# Altium project OvcharkaBoard.PrjPcb
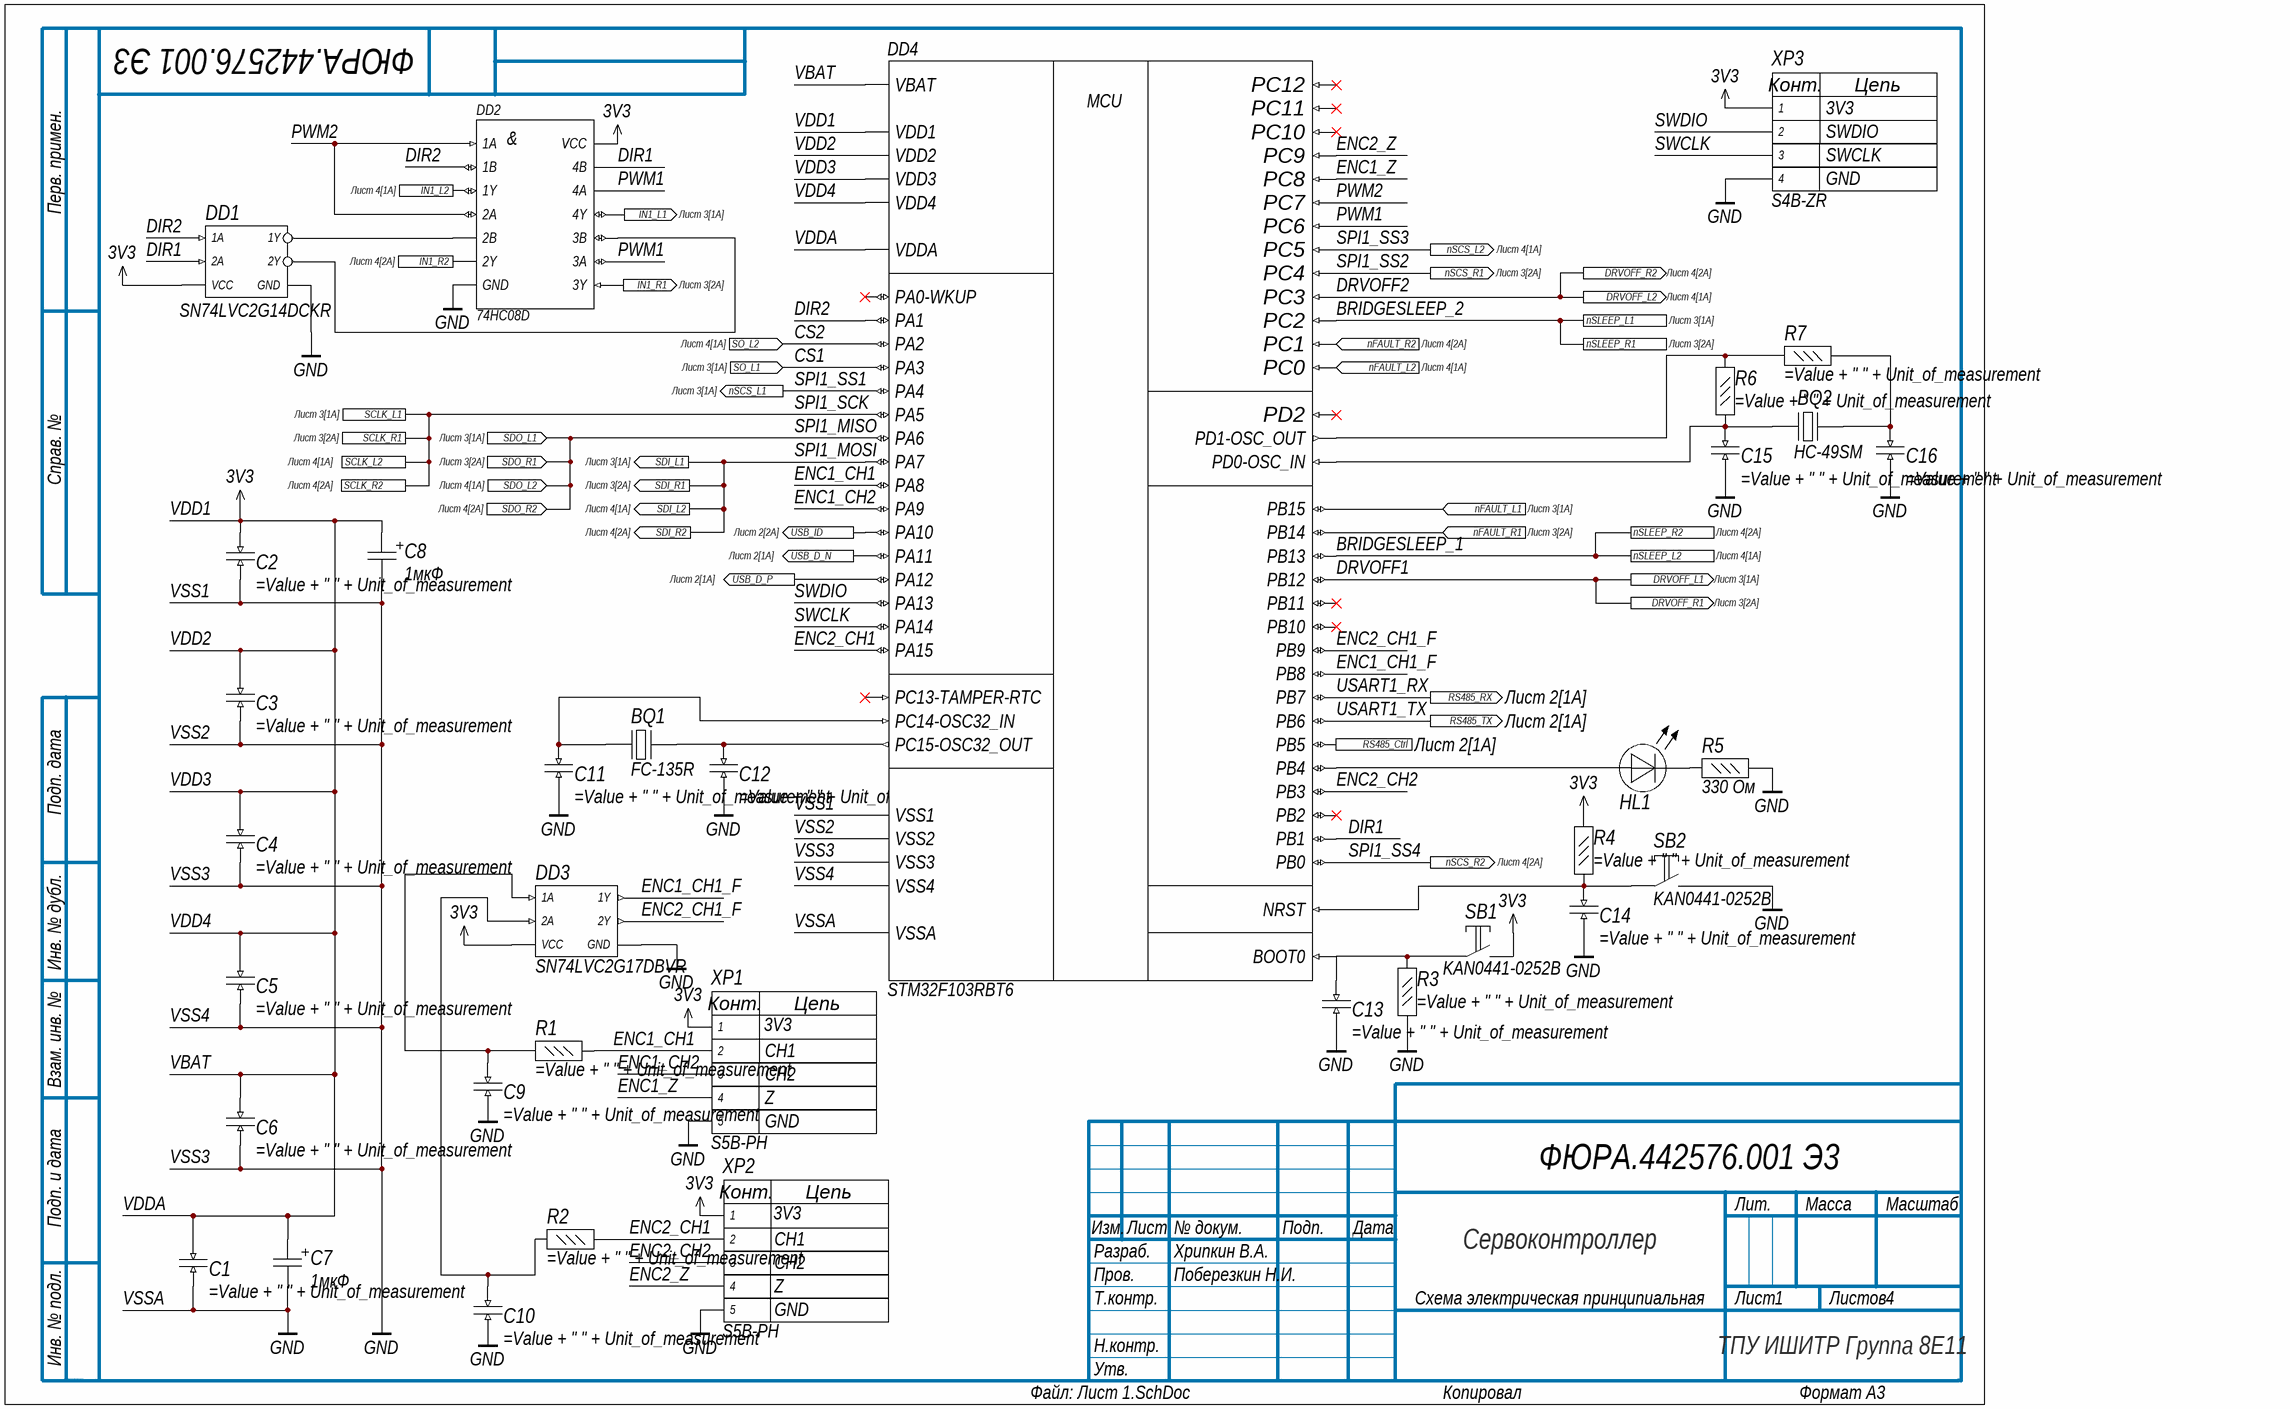
[diagram p0: Лист 1.SchDoc]
4 sheets, 116 parts. Net scope: flat (ports and power ports of the same name join across sheets).
Board file: OvcharkaBoard.PcbDoc
Sheets:
  Лист 1.SchDoc
  Лист 2.SchDoc
  Лист 3.SchDoc
  Лист 4.SchDoc

## Sheet Лист 1.SchDoc
size 420 x 297 mm; Author: ALTIUM GOSTBOM2.0 KEV; DrawnBy: Khripkinvlan; SheetNumber: 1; SheetTotal: 4; Вид_документа_SCH: Схема электрическая принципиальная; Наименование2: Сервоконтроллер; п_Разраб_Р: Хрипкин В.А.; п_Пров_Р: Поберезкин Н.И.; Наименование_организации: ТПУ ИШИТР Группа 8Е11; Обозначение_Код: ФЮРА.442576.001 Э3

### Parts
BQ1  FC-135R  [FC-135R]
BQ2  HC-49SM  [HC-49SM]
C1  (no value)  [CAP_0603]
C2  (no value)  [CAP_0603]
C3  (no value)  [CAP_0603]
C4  (no value)  [CAP_0603]
C5  (no value)  [CAP_0603]
C6  (no value)  [CAP_0603]
C7  1мкФ  [TECAP_A]
C8  1мкФ  [TECAP_A]
C9  (no value)  [CAP_0603]
C10  (no value)  [CAP_0603]
C11  (no value)  [CAP_0603]
C12  (no value)  [CAP_0603]
C13  (no value)  [CAP_0603]
C14  (no value)  [CAP_0603]
C15  (no value)  [CAP_0603]
C16  (no value)  [CAP_0603]
DD1  SN74LVC2G14DCKR  [SOT363 (SC70-6)]
DD2  74HC08D  [SO14]
DD3  SN74LVC2G17DBVR  [SOT23-6]
DD4  STM32F103RBT6  [LQFP-64]
HL1  3  [LED_0805]  (value not drawn)
R1  (no value)  [RES_0603]
R2  (no value)  [RES_0603]
R3  (no value)  [RES_0603]
R4  (no value)  [RES_0603]
R5  330 Ом  [RES_0603]
R6  (no value)  [RES_0603]
R7  (no value)  [RES_0603]
SB1  KAN0441-0252B  [SMD-BUTTON_6x3.5]
SB2  KAN0441-0252B  [SMD-BUTTON_6x3.5]
XP1  S5B-PH  [S5B-PH-K-S]
XP2  S5B-PH  [S5B-PH-K-S]
XP3  S4B-ZR  [S4B-ZR-SM4A-TF]

### Ports
DRVOFF_L1 (out, see Лист 3[1A]), DRVOFF_L2 (out, see Лист 4[1A]), DRVOFF_R1 (out, see Лист 3[2A]), DRVOFF_R2 (out, see Лист 4[2A]), IN1_L1 (out, see Лист 3[1A]), IN1_L2 (out, see Лист 4[1A]), IN1_R1 (out, see Лист 3[2A]), IN1_R2 (out, see Лист 4[2A]), nFAULT_L1 (in, see Лист 3[1A]), nFAULT_L2 (in, see Лист 4[1A]), nFAULT_R1 (in, see Лист 3[2A]), nFAULT_R2 (in, see Лист 4[2A]), nSCS_L1 (out, see Лист 3[1A]), nSCS_L2 (out, see Лист 4[1A]), nSCS_R1 (out, see Лист 3[2A]), nSCS_R2 (out, see Лист 4[2A]), nSLEEP_L1 (see Лист 3[1A]), nSLEEP_L2 (see Лист 4[1A]), nSLEEP_R1 (see Лист 3[2A]), nSLEEP_R2 (see Лист 4[2A]), RS485_Ctrl (out, see Лист 2[1A]), RS485_RX (out, see Лист 2[1A]), RS485_TX (out, see Лист 2[1A]), SCLK_L1 (see Лист 3[1A]), SCLK_L2 (see Лист 4[1A]), SCLK_R1 (see Лист 3[2A]), SCLK_R2 (see Лист 4[2A]), SDI_L1 (out, see Лист 3[1A]), SDI_L2 (out, see Лист 4[1A]), SDI_R1 (out, see Лист 3[2A]), SDI_R2 (out, see Лист 4[2A]), SDO_L1 (in, see Лист 3[1A]), SDO_L2 (in, see Лист 4[1A]), SDO_R1 (in, see Лист 3[2A]), SDO_R2 (in, see Лист 4[2A]), SO_L1 (in, see Лист 3[1A]), SO_L2 (in, see Лист 4[1A]), USB_D_N (out, see Лист 2[1A]), USB_D_P (out, see Лист 2[1A]), USB_ID (out, see Лист 2[2A])

### Nets
GND: C1.1 C2.1 C3.1 C4.1 C5.1 C6.1 C7.2 C8.2 C9.1 C10.1 C11.1 C12.1 C13.1 C14.1 C15.1 C16.1 DD1.2(GND) DD2.7(GND) DD3.2(GND) DD4.12(VSSA) DD4.18(VSS1) DD4.31(VSS2) DD4.47(VSS3) DD4.63(VSS4) R3.2 R5.2 SB2.2(S2) XP1.5 XP2.5 XP3.4  [also labelled VSS1, VSS2, VSS3, VSS4, VSSA]  [project net SL1]
VBAT: C1.2 C2.2 C3.2 C4.2 C5.2 C6.2 C7.1 C8.1 DD1.5(VCC) DD2.14(VCC) DD3.5(VCC) DD4.1(VBAT) DD4.13(VDDA) DD4.19(VDD1) DD4.32(VDD2) DD4.48(VDD3) DD4.64(VDD4) R4.2 SB1.2(S2) XP1.1 XP2.1 XP3.1  [also labelled 3V3, VDD1, VDD2, VDD3, VDD4, VDDA]
BRIDGESLEEP_1: DD4.34(PB13) ; port nSLEEP_L2, port nSLEEP_R2
BRIDGESLEEP_2: DD4.10(PC2) ; port nSLEEP_L1, port nSLEEP_R1
CS1: DD4.17(PA3) ; port SO_L1
CS2: DD4.16(PA2) ; port SO_L2
DIR1: DD1.3(2A) DD2.13(4B) DD4.27(PB1)  [project net DIR1_1]
DIR2: DD1.1(1A) DD2.2(1B) DD4.15(PA1)  [project net DIR2_1]
DRVOFF1: DD4.33(PB12) ; port DRVOFF_L1, port DRVOFF_R1
DRVOFF2: DD4.11(PC3) ; port DRVOFF_L2, port DRVOFF_R2
ENC1_CH1: DD4.41(PA8) R1.2 XP1.2  [project net ENC1_CH1_1]
ENC1_CH1_F: DD3.6(1Y) DD4.61(PB8)  [project net ENC1_CH1_F_1]
ENC1_CH2: DD4.42(PA9) XP1.3  [project net ENC1_CH2_1]
ENC1_Z: DD4.39(PC8) XP1.4  [project net ENC1_Z_1]
ENC2_CH1: DD4.50(PA15) R2.2 XP2.2  [project net ENC2_CH1_1]
ENC2_CH1_F: DD3.4(2Y) DD4.62(PB9)  [project net ENC2_CH1_F_1]
ENC2_CH2: DD4.55(PB3) XP2.3  [project net ENC2_CH2_1]
ENC2_Z: DD4.40(PC9) XP2.4  [project net ENC2_Z_1]
PWM1: DD2.9(3A) DD2.12(4A) DD4.37(PC6)  [project net PWM1_1]
PWM2: DD2.1(1A) DD2.4(2A) DD4.38(PC7)  [project net PWM2_1]
SPI1_MISO: DD4.22(PA6) ; port SDO_L1, port SDO_R1, port SDO_L2, port SDO_R2
SPI1_MOSI: DD4.23(PA7) ; port SDI_L1, port SDI_R1, port SDI_L2, port SDI_R2
SPI1_SCK: DD4.21(PA5) ; port SCLK_L1, port SCLK_R1, port SCLK_L2, port SCLK_R2
SPI1_SS1: DD4.20(PA4) ; port nSCS_L1
SPI1_SS2: DD4.24(PC4) ; port nSCS_R1
SPI1_SS3: DD4.25(PC5) ; port nSCS_L2
SPI1_SS4: DD4.26(PB0) ; port nSCS_R2
SWCLK: DD4.49(PA14) XP3.3  [project net SWCLK_1]
SWDIO: DD4.46(PA13) XP3.2  [project net SWDIO_1]
USART1_RX: DD4.59(PB7) ; port RS485_RX
USART1_TX: DD4.58(PB6) ; port RS485_TX
USB_D_N: DD4.44(PA11) ; port USB_D_N
USB_D_P: DD4.45(PA12) ; port USB_D_P
NetBQ1_1: BQ1.1 C11.2 DD4.3(PC14-OSC32_IN)
NetBQ1_2: BQ1.2 C12.2 DD4.4(PC15-OSC32_OUT)
NetBQ2_1: BQ2.1 C15.2 DD4.5(PD0-OSC_IN) R6.1
NetBQ2_2: BQ2.2 C16.2 R7.2
NetC9_2: C9.2 DD3.1(1A) R1.1
NetC10_2: C10.2 DD3.3(2A) R2.1
NetC13_2: C13.2 DD4.60(BOOT0) R3.1 SB1.1(S1)
NetC14_2: C14.2 DD4.7(NRST) R4.1 SB2.1(S1)
NetDD1_4: DD1.4(2Y) DD2.10(3B)
NetDD1_6: DD1.6(1Y) DD2.5(2B)
NetDD2_3: DD2.3(1Y) ; port IN1_L2
NetDD2_6: DD2.6(2Y) ; port IN1_R2
NetDD2_8: DD2.8(3Y) ; port IN1_R1
NetDD2_11: DD2.11(4Y) ; port IN1_L1
NetDD4_6: DD4.6(PD1-OSC_OUT) R6.2 R7.1
NetDD4_8: DD4.8(PC0) ; port nFAULT_L2
NetDD4_9: DD4.9(PC1) ; port nFAULT_R2
NetDD4_35: DD4.35(PB14) ; port nFAULT_R1
NetDD4_36: DD4.36(PB15) ; port nFAULT_L1
NetDD4_43: DD4.43(PA10) ; port USB_ID
NetDD4_56: DD4.56(PB4) HL1.A
NetDD4_57: DD4.57(PB5) ; port RS485_Ctrl
NetHL1_C: HL1.C R5.1

Not connected (* = marked no-connect by the designer): DD4 2(PC13-TAMPER-RTC)* 14(PA0-WKUP)* 28(PB2)* 29(PB10)* 30(PB11)* 51(PC10)* 52(PC11)* 53(PC12)* 54(PD2)*

### Notes on the sheet
- SWDIO
- SWCLK
- 3V3
- GND
- CH1
- CH2
- Z
- Перв. примен.
- Справ. №
- Подп. дата
- Инв. № дубл.
- Взам. инв. №
- Подп. и дата
- Изм.
- Разраб.
- Лист
- № докум.
- Подп.
- Дата
- Лит.
- Масса
- Масштаб
- Пров.
- Т.контр.
- Листов
- Инв. № подл.
- Н.контр.
- Утв.
- ALTIUM GOSTBOM2.0 KEV
- Файл:
- Копировал
- Формат А3
- (in symbol 74HC08D) &
- (in symbol S4B-ZR) Конт.; Цепь
- (in symbol S5B-PH) Конт.; Цепь
- (in symbol STM32F103RBT6) MCU

### Library data of the parts
BQ1 = FC-135R: Кварцевый резонатор 32,768 кГц; SMD; ComponentLink1Description: Datasheet; ComponentLink1URL: C:\GitHub\OvcharkaBoard\Datasheets\Components
BQ2 = HC-49SM: Кварцевый резонатор 8 МГц; SMD; ComponentLink1Description: Datasheet; ComponentLink1URL: C:\GitHub\OvcharkaBoard\Datasheets\Components
C1-C6 C13 C14 = CAP_0603: Конденсатор керамический, типоразмера 0603; Value: 100; Unit_of_measurement: нФ; ComponentLink1Description: New link; ComponentLink1URL: *
C7 C8 = TECAP_A: Описание свойств компонента; Value: 1; Unit_of_measurement: мкФ
C9 C10 = CAP_0603: Конденсатор керамический, типоразмера 0603; Value: 10; Unit_of_measurement: пФ; ComponentLink1Description: New link; ComponentLink1URL: *
C11 C12 C15 C16 = CAP_0603: Конденсатор керамический, типоразмера 0603; Value: 20; Unit_of_measurement: пФ; ComponentLink1Description: New link; ComponentLink1URL: *
DD1 = SN74LVC2G14DCKR: Сдвоенный инвертор с триггером Шмидта
DD2 = 74HC08D: Логическая ИС, QUAD 2-INPUT AND GATE
DD3 = SN74LVC2G17DBVR: Сдвоенный буфер с триггером Шмитта на входе
DD4 = STM32F103RBT6: Микроконтроллер 32-Бит, Cortex-M3, 72МГц, 128КБ Flash, USB, CAN [LQFP-64]
HL1 = LED_0805_O: Светодиод оранжевый SMD 0805=2x1.3мм, 70мКд, 130°, 625нм (Orange); №7339 o СД SMD02013C2\оран\ 70\130\пр\FYLS-0805UEC\; Unit_of_measurement: Ом; Value: *; ComponentLink1Description: New link; ComponentLink1URL: *
R1 R2 R7 = RES_0603: Резистор, типоразмера 0603; Value: 100; Unit_of_measurement: кОм; ComponentLink1Description: New link; ComponentLink1URL: *
R3 R4 = RES_0603: Резистор, типоразмера 0603; Value: 10; Unit_of_measurement: кОм; ComponentLink1Description: New link; ComponentLink1URL: *
R5 = RES_0603: Резистор, типоразмера 0603; Value: 330; ComponentLink1Description: New link; ComponentLink1URL: *; Unit_of_measurement: Ом
R6 = RES_0603: Резистор, типоразмера 0603; Value: 1; Unit_of_measurement: МОм; ComponentLink1Description: New link; ComponentLink1URL: *
SB1 SB2 = SMD-Button_6x3.5: Описание свойств компонента
XP1 XP2 = S5B-PH: JST PH 5pin 2 mm pitch; horizontal; through hole OR full smd; S5B-PH-SM4-TB
XP3 = S4B-ZR: JST ZH 4pin 1.5 mm pitch; horizontal; through hole OR full smd; S4B-ZR

## Sheet Лист 2.SchDoc
size 420 x 297 mm; Author: ALTIUM GOSTBOM2.0 KEV; SheetNumber: 2; SheetTotal: 4; Обозначение_Код: ФЮРА.442576.001 Э3
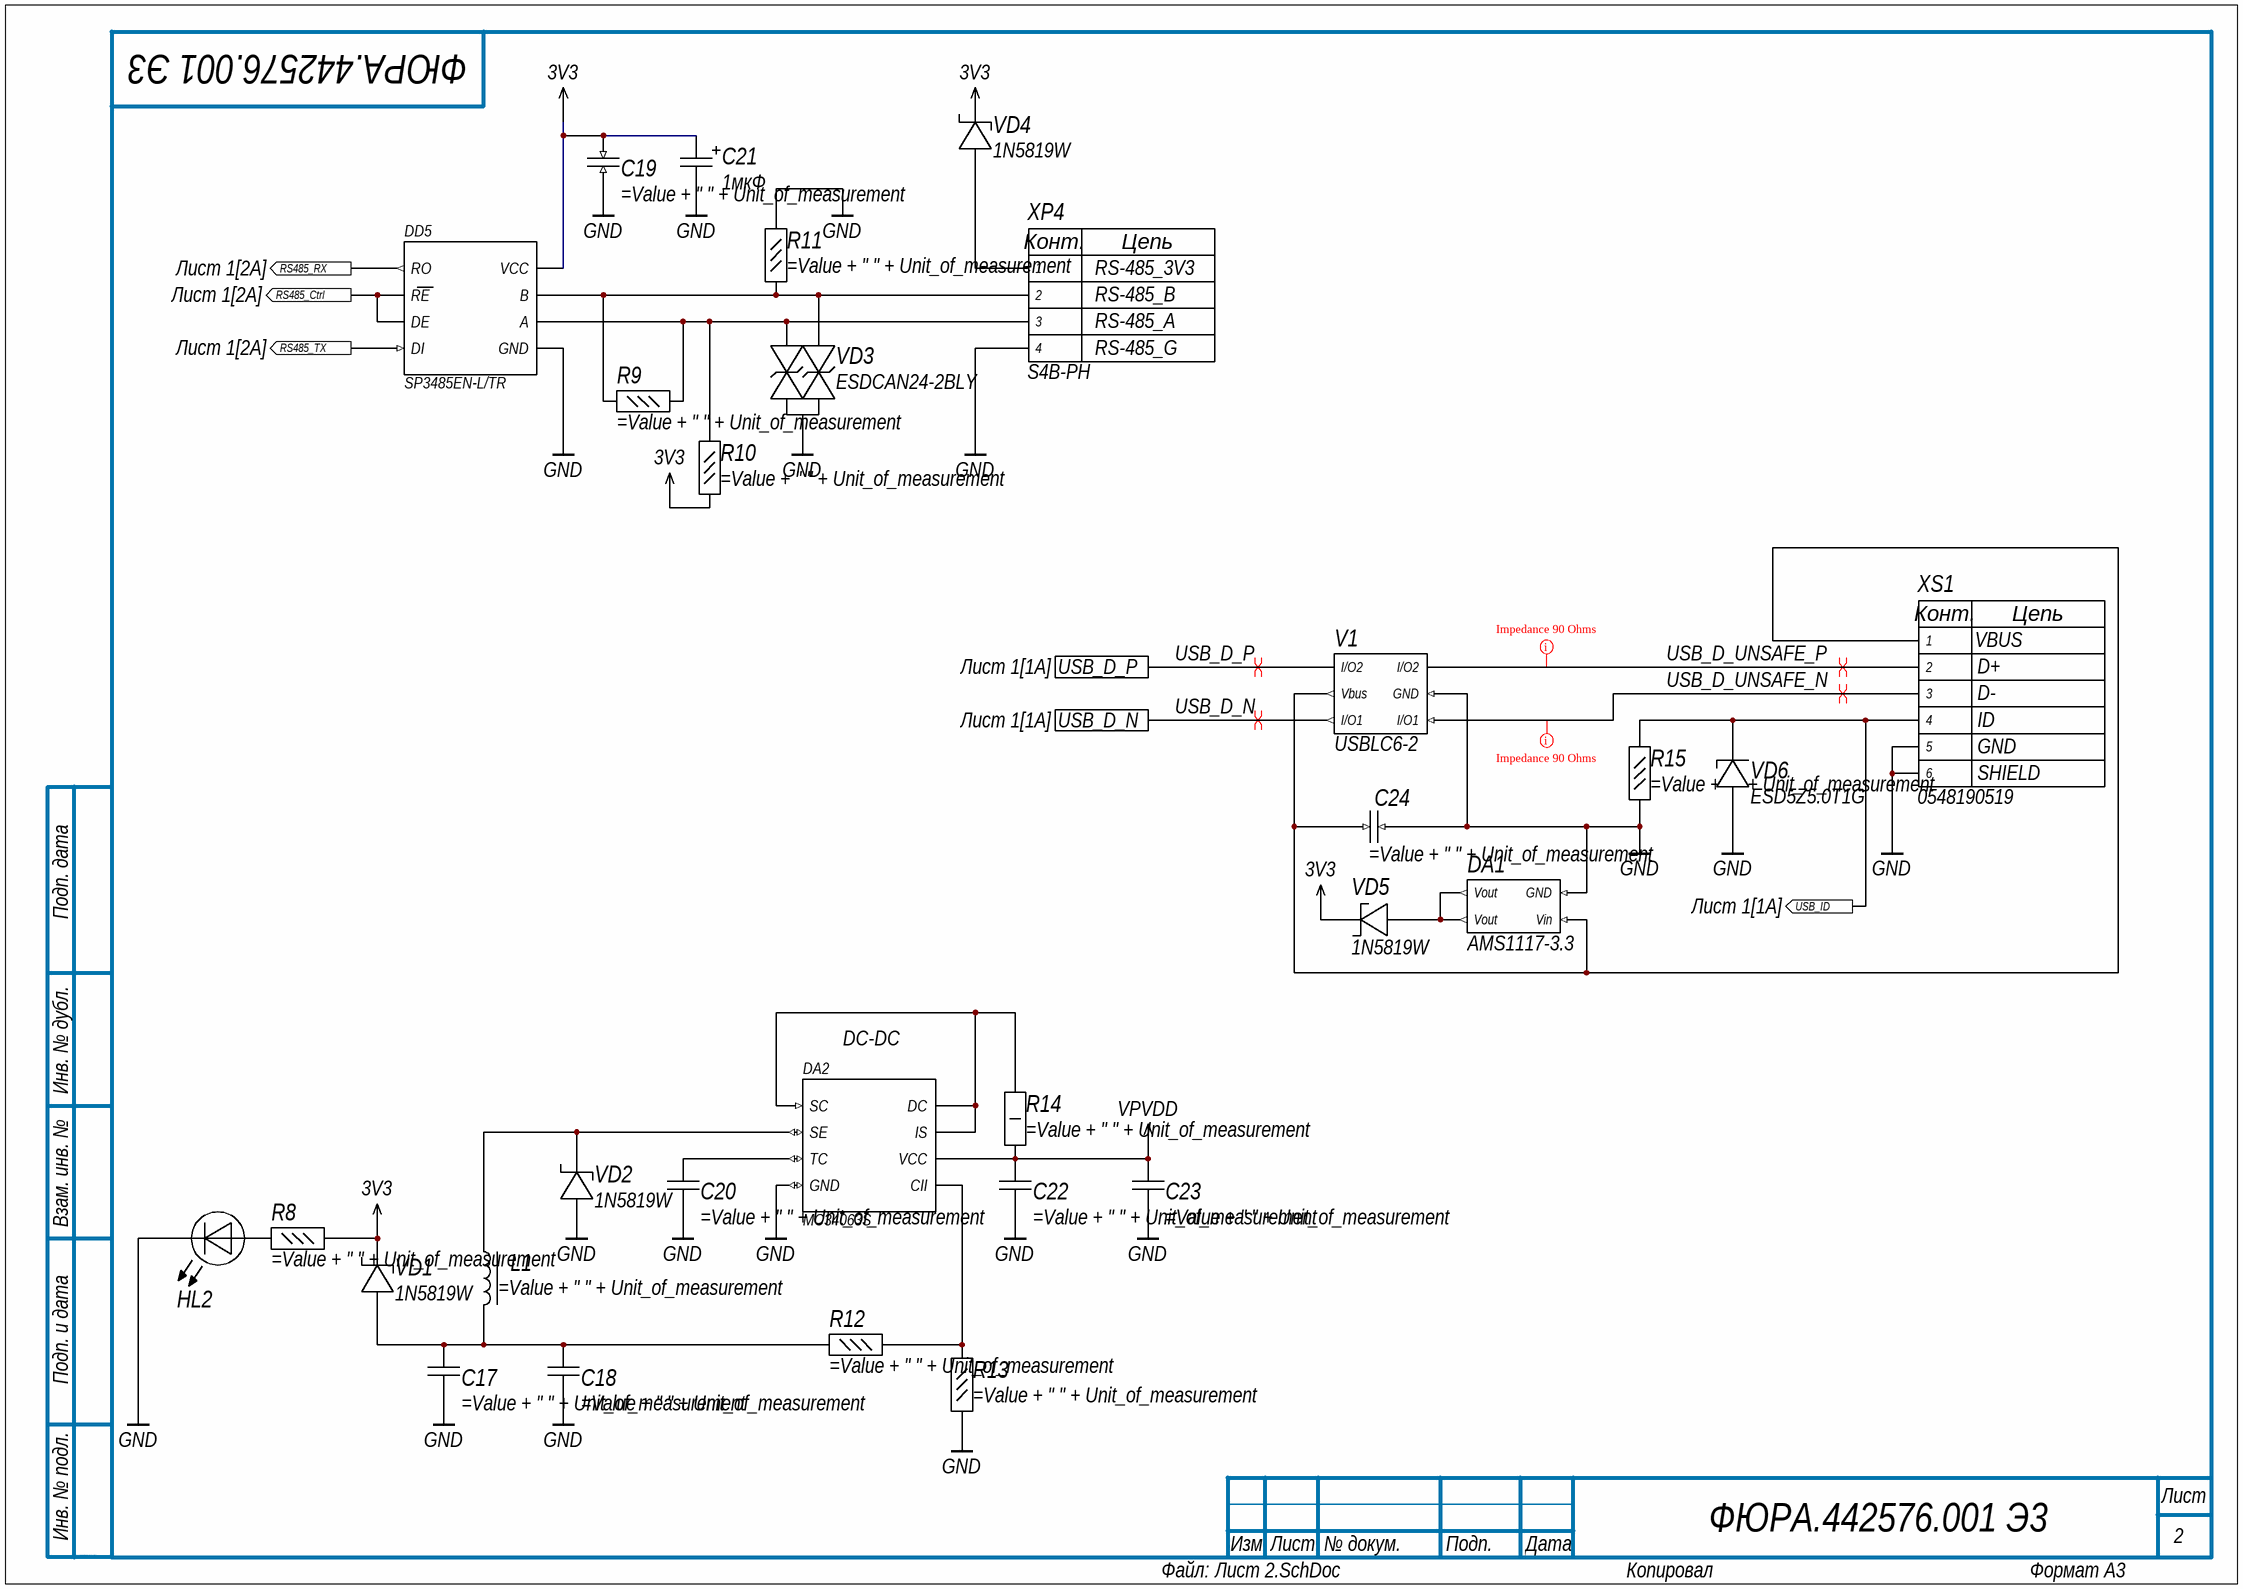
[diagram p1: Лист 2.SchDoc]

### Parts
C17  (no value)  [CAP_1206]
C18  (no value)  [CAP_1206]
C19  (no value)  [CAP_0603]
C20  (no value)  [CAP_0603]
C21  1мкФ  [TECAP_A]
C22  (no value)  [CAP_1206]
C23  (no value)  [CAP_1206]
C24  (no value)  [CAP_0603]
DA1  AMS1117-3.3  [SOT-223]
DA2  MC34063S  [SOP-8 WithoutTP]
DD5  SP3485EN-L/TR  [SOIC-8 WIthoutTP]
HL2  3  [LED_0805]  (value not drawn)
L1  (no value)  [CD54]
R8  (no value)  [RES_0603]
R9  (no value)  [RES_0603]
R10  (no value)  [RES_0603]
R11  (no value)  [RES_0603]
R12  (no value)  [RES_0603]
R13  (no value)  [RES_0603]
R14  (no value)  [RES_2512]
R15  (no value)  [RES_0603]
V1  USBLC6-2  [SOT23-6]
VD1  1N5819W  [SOD-123]
VD2  1N5819W  [SOD-123]
VD3  ESDCAN24-2BLY  [SOT23]
VD4  1N5819W  [SOD-123]
VD5  1N5819W  [SOD-123]
VD6  ESD5Z5.0T1G  [SOD-523]
XP4  S4B-PH  [S4B-PH]
XS1  0548190519  [USB_Mini_B_TH]

### Ports
RS485_Ctrl (out, see Лист 1[2A]), RS485_RX (out, see Лист 1[2A]), RS485_TX (out, see Лист 1[2A]), USB_D_N (see Лист 1[1A]), USB_D_P (see Лист 1[1A]), USB_ID (out, see Лист 1[1A])

### Nets
3V3: C19.2 C21.1 DD5.8(VCC) R8.1 R10.2 VD1.1 VD4.1 VD5.1  [project net VBAT]
GND: C17.1 C18.1 C19.1 C20.1 C21.2 C22.1 C23.1 C24.1 DA1.1(GND) DA2.4(GND) DD5.5(GND) HL2.C R11.2 R13.1 R15.1 V1.2(GND) VD2.2 VD3.3 VD6.2 XP4.4 XS1.1(5) XS1.6  [project net SL1]
VPVDD: C22.2 C23.2 DA2.6(VCC) R14.1  [project net DRAIN]
USART1_RX: DD5.1(RO) ; port RS485_RX
USART1_TX: DD5.4(DI) ; port RS485_TX
USB_D_N: V1.6(I/O1) ; port USB_D_N
USB_D_P: V1.4(I/O2) ; port USB_D_P
USB_D_UNSAFE_N: V1.1(I/O1) XS1.4(3)  [project net USB_D_UNSAFE_N_2]
USB_D_UNSAFE_P: V1.3(I/O2) XS1.3(2)  [project net USB_D_UNSAFE_P_2]
NetC17_2: C17.2 C18.2 L1.2 R12.1 VD1.2
NetC20_2: C20.2 DA2.3(TC)
NetC24_2: C24.2 DA1.3(Vin) V1.5(Vbus) XS1.5(1)
NetDA1_2: DA1.2(Vout) DA1.4(Vout) VD5.2
NetDA2_1: DA2.1(SC) DA2.7(IS) DA2.8(DC) R14.2
NetDA2_2: DA2.2(SE) L1.1 VD2.1
NetDA2_5: DA2.5(CII) R12.2 R13.2
NetDD4_43: R15.2 VD6.1 XS1.2(4) ; port USB_ID
NetDD4_57: DD5.2(RE) DD5.3(DE) ; port RS485_Ctrl
NetDD5_6: DD5.6(A) R9.2 R10.1 VD3.2 XP4.3
NetDD5_7: DD5.7(B) R9.1 R11.1 VD3.1 XP4.2
NetHL2_A: HL2.A R8.2
NetVD4_2: VD4.2 XP4.1

### Layout directives
differential pair: USB_D_N, USB_D_P, USB_D_UNSAFE_N_2, USB_D_UNSAFE_P_2
mark named Impedance 90 Ohms: USB_D_UNSAFE_N_2, USB_D_UNSAFE_P_2

### Notes on the sheet
- RS-485_3V3
- RS-485_B
- RS-485_A
- RS-485_G
- (near DA2) DC-DC
- Подп. дата
- Инв. № дубл.
- Взам. инв. №
- Подп. и дата
- Инв. № подл.
- Изм.
- Лист
- № докум.
- Подп.
- Дата
- ALTIUM GOSTBOM2.0 KEV
- Файл:
- Копировал
- Формат А3
- (in symbol 0548190519) Конт.; Цепь; VBUS; D+; D-; ID; GND; SHIELD
- (in symbol S4B-PH) Конт.; Цепь

### Library data of the parts
C17 C18 C22 C23 = CAP_1206: Конденсатор керамический, типоразмера 1206; Value: 10; Unit_of_measurement: мкФ 50В; ComponentLink1Description: New link; ComponentLink1URL: *
C19 C24 = CAP_0603: as C1 on sheet Лист 1; ComponentLink1Description: New link; ComponentLink1URL: *
C20 = CAP_0603: as C9 on sheet Лист 1; ComponentLink1Description: New link; ComponentLink1URL: *
C21 = TECAP_A: as C7 on sheet Лист 1
DA1 = AMS1117-3.3: Линейный регулятор с малым падением напряжения, 1А, 3.3В [SOT-223]
DA2 = MC34063S: The MC34063is a monolithic regulator subsystem, / intended for use as DC to DC converter. This device contains a / temperature compensated band gap reference, a duty-cycle / control oscillator, driver and high current output switch. It can be / used for step down, step-up or inverting switching regulators as / well as for series pass regulators.
DD5 = SP3485EN: Трансивер RS485 Half-Duplex 1/1
HL2 = LED_0805_R: Светодиод SMD 0805=2x1.3мм, красный, 28мкд, 130град, прозрачная линза; Q-15575B СД SMD02013C2\кр\ 28,5\130\пр\FYLS- 0805HD\FORYARD; Unit_of_measurement: Ом; Value: *; ComponentLink1Description: New link; ComponentLink1URL: *
L1 = IND_CD54: Резистор, типоразмера 2010; Value: 47; Unit_of_measurement: мкГн; ComponentLink1Description: New link; ComponentLink1URL: *
R8 = RES_0603: Резистор, типоразмера 0603; Value: 330; Unit_of_measurement: Ом; ComponentLink1Description: New link; ComponentLink1URL: *
R9 = RES_0603: Резистор, типоразмера 0603; Value: 120; Unit_of_measurement: Ом; ComponentLink1Description: New link; ComponentLink1URL: *
R10 R11 = RES_0603: Резистор, типоразмера 0603; Value: 4.7; Unit_of_measurement: кОм; ComponentLink1Description: New link; ComponentLink1URL: *
R12 = RES_0603: Резистор, типоразмера 0603; Value: 8.2; Unit_of_measurement: кОм 1%; ComponentLink1Description: New link; ComponentLink1URL: *
R13 = RES_0603: Резистор, типоразмера 0603; Value: 4.3; Unit_of_measurement: кОм 1%; ComponentLink1Description: New link; ComponentLink1URL: *
R14 = RES_2512: Резистор, типоразмера 2512; Value: 0.2; Unit_of_measurement: Ом 1%; ComponentLink1Description: New link; ComponentLink1URL: *
R15 = RES_0603: as R1 on sheet Лист 1; ComponentLink1Description: New link; ComponentLink1URL: *
V1 = USBLC6-2: Защита интерфейса USB от электростатических разрядов [SOT-23-6]
VD1 VD2 VD4 VD5 = 1N5819W: Диод Шоттки, 40 В, 0.35 А, SOD-123; Unit_of_measurement: Ом; Value: *; ComponentLink1Description: New link; ComponentLink1URL: *
VD3 = ESDCAN24-2BLY: Устройство защиты CAN шины от ESD, 2 защитных диода [SOT-23-3]; Unit_of_measurement: Ом; Value: *; ComponentLink1Description: New link; ComponentLink1URL: *
VD6 = ESD5Z5.0T1G: Устройство защиты от ESD, защитный диод, 5В [SOD-523]; Unit_of_measurement: Ом; Value: *; ComponentLink1Description: New link; ComponentLink1URL: *
XP4 = S4B-PH: JST PH 4pin 2 mm pitch; horizontal; through hole OR full smd; S4B-PH-SM4-TB
XS1 = 0548190519: USB - mini B USB 2.0 OTG Receptacle Connector 5 Position Through Hole, Right Angle

## Sheet Лист 3.SchDoc
size 420 x 297 mm; Author: ALTIUM GOSTBOM2.0 KEV; SheetNumber: 3; SheetTotal: 4; Обозначение_Код: ФЮРА.442576.001 Э3
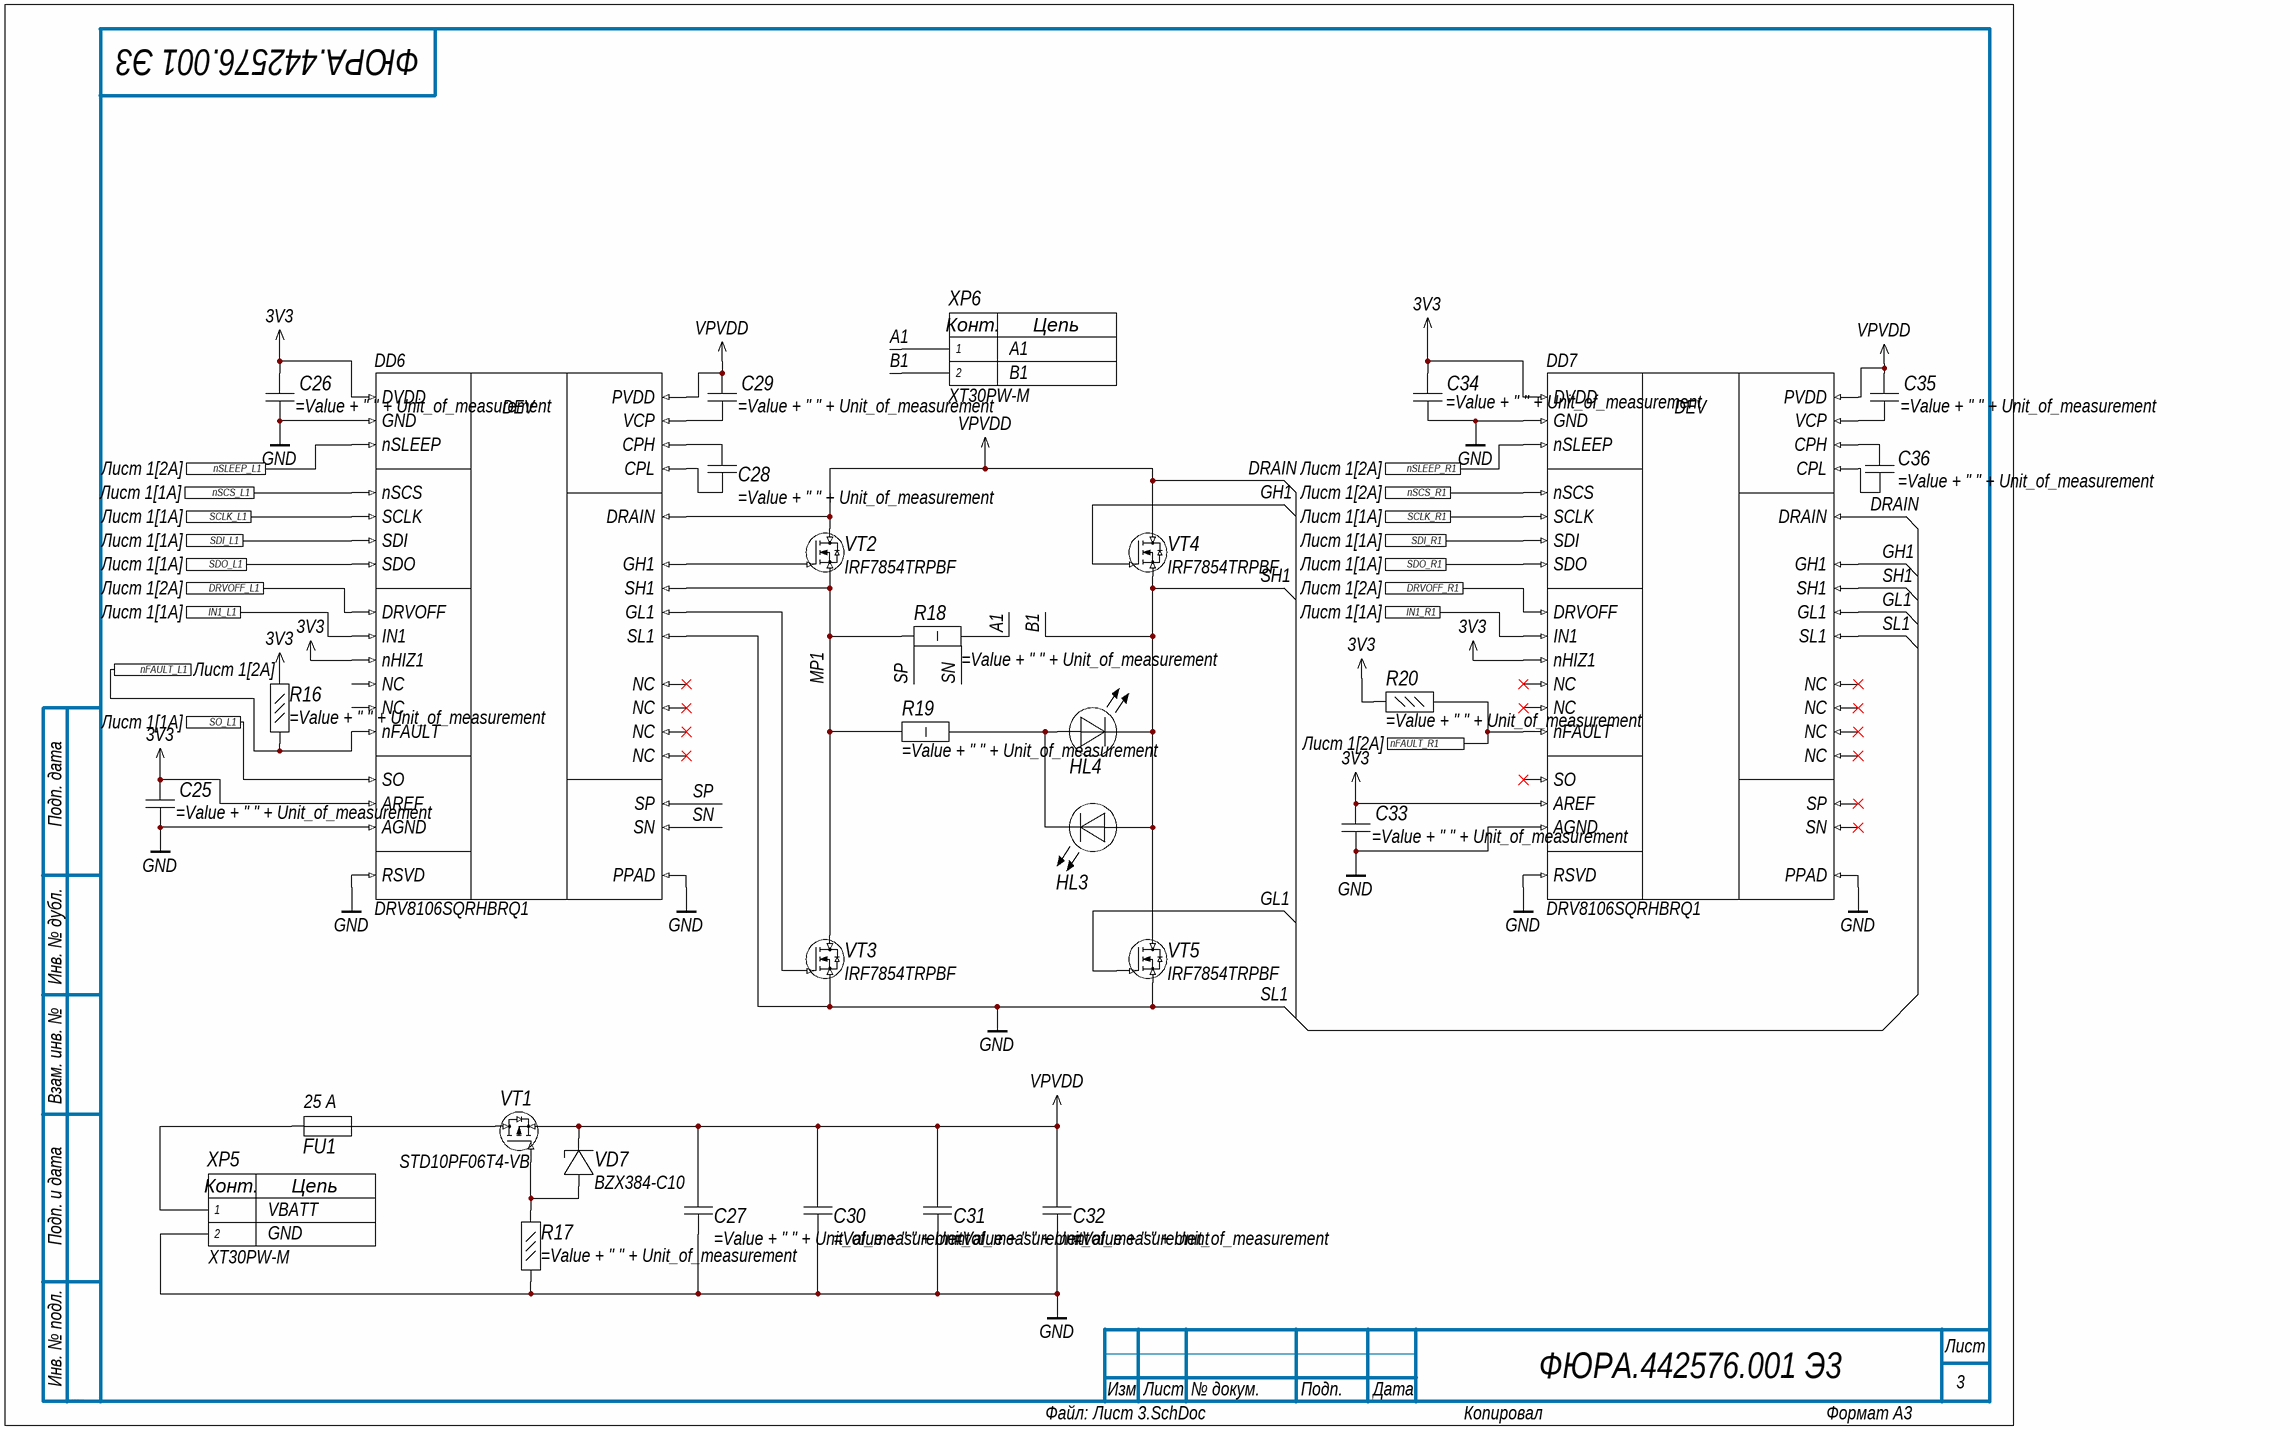
[diagram p2: Лист 3.SchDoc]

### Parts
C25  (no value)  [CAP_0603]
C26  (no value)  [CAP_0603]
C27  (no value)  [CAP_0603]
C28  (no value)  [CAP_0603]
C29  (no value)  [CAP_0603]
C30  (no value)  [CAP_1206]
C31  (no value)  [CAP_1206]
C32  (no value)  [CAP_1206]
C33  (no value)  [CAP_0603]
C34  (no value)  [CAP_0603]
C35  (no value)  [CAP_0603]
C36  (no value)  [CAP_0603]
DD6  DRV8106SQRHBRQ1  [VQFN32]
DD7  DRV8106SQRHBRQ1  [VQFN32]
FU1  ва  [Fuse 5x20]  (value not drawn)
HL3  3  [LED_0805]  (value not drawn)
HL4  3  [LED_0805]  (value not drawn)
R16  (no value)  [RES_0603]
R17  (no value)  [RES_0603]
R18  (no value)  [RES_2512]
R19  (no value)  [RES_2512]
R20  (no value)  [RES_0603]
VD7  BZX384-C10  [SOD-323]
VT1  STD10PF06T4-VB  [DPAK_TO252]
VT2  IRF7854TRPBF  [SOP-8 WithoutTP]
VT3  IRF7854TRPBF  [SOP-8 WithoutTP]
VT4  IRF7854TRPBF  [SOP-8 WithoutTP]
VT5  IRF7854TRPBF  [SOP-8 WithoutTP]
XP5  XT30PW-M  [XT30PW-M]
XP6  XT30PW-M  [XT30PW-M]

### Ports
DRVOFF_L1 (see Лист 1[2A]), DRVOFF_R1 (see Лист 1[2A]), IN1_L1 (see Лист 1[1A]), IN1_R1 (see Лист 1[1A]), nFAULT_L1 (see Лист 1[2A]), nFAULT_R1 (see Лист 1[2A]), nSCS_L1 (see Лист 1[1A]), nSCS_R1 (see Лист 1[2A]), nSLEEP_L1 (see Лист 1[2A]), nSLEEP_R1 (see Лист 1[2A]), SCLK_L1 (see Лист 1[1A]), SCLK_R1 (see Лист 1[1A]), SDI_L1 (see Лист 1[1A]), SDI_R1 (see Лист 1[1A]), SDO_L1 (see Лист 1[1A]), SDO_R1 (see Лист 1[1A]), SO_L1 (see Лист 1[1A])

### Nets
3V3: C25.2 C26.2 C33.2 C34.2 DD6.2(DVDD) DD6.8(nHIZ1) DD6.16(AREF) DD7.2(DVDD) DD7.8(nHIZ1) DD7.16(AREF) R16.2 R20.2  [project net VBAT]
DRAIN: C27.2 C29.2 C30.2 C31.2 C32.2 C35.2 DD6.28(DRAIN) DD6.29(PVDD) DD7.28(DRAIN) DD7.29(PVDD) VD7.1 VT1.3(S) VT2.3 VT4.3  [also labelled VPVDD]
SL1: C25.1 C26.1 C27.1 C30.1 C31.1 C32.1 C33.1 C34.1 DD6.0(PPAD) DD6.1(GND) DD6.15(RSVD) DD6.17(AGND) DD6.23(SL1) DD7.0(PPAD) DD7.1(GND) DD7.15(RSVD) DD7.17(AGND) DD7.23(SL1) R17.1 VT3.2 VT5.2 XP5.2  [also labelled GND]
A1: R18.1 XP6.1  [project net A1_3]
B1: DD7.21(SH1) HL3.A HL4.C VT4.2 VT5.3 XP6.2  [also labelled SH1]  [project net B1_3]
BRIDGESLEEP_2: DD6.11(nSLEEP) DD7.11(nSLEEP) ; port nSLEEP_L1, port nSLEEP_R1
CS1: DD6.14(SO) ; port SO_L1
DRVOFF1: DD6.12(DRVOFF) DD7.12(DRVOFF) ; port DRVOFF_L1, port DRVOFF_R1
GH1: DD7.20(GH1) VT4.1  [project net GH1_3]
GL1: DD7.22(GL1) VT5.1  [project net GL1_3]
MP1: DD6.21(SH1) R18.2 R19.1 VT2.2 VT3.3  [project net MP1_3]
SN: DD6.19(SN) R18.1  [project net SN_3]
SP: DD6.18(SP) R18.2  [project net SP_3]
SPI1_MISO: DD6.6(SDO) DD7.6(SDO) ; port SDO_L1, port SDO_R1
SPI1_MOSI: DD6.5(SDI) DD7.5(SDI) ; port SDI_L1, port SDI_R1
SPI1_SCK: DD6.4(SCLK) DD7.4(SCLK) ; port SCLK_L1, port SCLK_R1
SPI1_SS1: DD6.3(nSCS) ; port nSCS_L1
SPI1_SS2: DD7.3(nSCS) ; port nSCS_R1
NetC28_1: C28.1 DD6.32(CPL)
NetC28_2: C28.2 DD6.31(CPH)
NetC29_1: C29.1 DD6.30(VCP)
NetC35_1: C35.1 DD7.30(VCP)
NetC36_1: C36.1 DD7.32(CPL)
NetC36_2: C36.2 DD7.31(CPH)
NetDD2_8: DD7.7(IN1) ; port IN1_R1
NetDD2_11: DD6.7(IN1) ; port IN1_L1
NetDD4_35: DD7.13(nFAULT) R20.1 ; port nFAULT_R1
NetDD4_36: DD6.13(nFAULT) R16.1 ; port nFAULT_L1
NetDD6_20: DD6.20(GH1) VT2.1
NetDD6_22: DD6.22(GL1) VT3.1
NetFU1_1: FU1.1 XP5.1
NetFU1_2: FU1.2 VT1.4(D)
NetHL3_C: HL3.C HL4.A R19.2
NetR17_2: R17.2 VD7.2 VT1.1(G)

Not connected (* = marked no-connect by the designer): DD6 9(NC) 10(NC) 24(NC)* 25(NC)* 26(NC)* 27(NC)*; DD7 9(NC)* 10(NC)* 14(SO)* 18(SP)* 19(SN)* 24(NC)* 25(NC)* 26(NC)* 27(NC)*

### Notes on the sheet
- A1
- B1
- (near FU1) 25 А
- VBATT
- GND
- Подп. дата
- Инв. № дубл.
- Взам. инв. №
- Подп. и дата
- Инв. № подл.
- Изм.
- Лист
- № докум.
- Подп.
- Дата
- ALTIUM GOSTBOM2.0 KEV
- Файл:
- Копировал
- Формат А3
- (in symbol DRV8106SQRHBRQ1) DEV
- (in symbol XT30PW-M) Конт.; Цепь

### Library data of the parts
C25 C26 C33 C34 = CAP_0603: Конденсатор керамический, типоразмера 0603; Value: 1; Unit_of_measurement: мкФ 6.3В; ComponentLink1Description: New link; ComponentLink1URL: *
C27 C28 C36 = CAP_0603: Конденсатор керамический, типоразмера 0603; Value: 0,1; Unit_of_measurement: мкФ 50 В; ComponentLink1Description: New link; ComponentLink1URL: *
C29 C35 = CAP_0603: Конденсатор керамический, типоразмера 0603; Value: 1; Unit_of_measurement: мкФ 16 В; ComponentLink1Description: New link; ComponentLink1URL: *
C30-C32 = CAP_1206: as C17 on sheet Лист 2; ComponentLink1Description: New link; ComponentLink1URL: *
DD6 DD7 = DRV8106SQRHBRQ1: Automotive, 40-V, half-bridge Smart Gate Driver w/offline diagnostics and inline current sense amp.
FU1 = Fuse: Предохранитель плавкий 5x20
HL3 HL4 = LED_0805: Светодиод SMD 0805=2x1.3мм, красный, 28мкд, 130град, прозрачная линза; Q-15575B СД SMD02013C2\кр\ 28,5\130\пр\FYLS- 0805HD\FORYARD; Unit_of_measurement: Ом; Value: *; ComponentLink1Description: New link; ComponentLink1URL: *
R16 R17 R20 = RES_0603: as R3 on sheet Лист 1; ComponentLink1Description: New link; ComponentLink1URL: *
R18 = ResShunt_2512: Резистор, типоразмера 2512; Value: 7.5; Unit_of_measurement: мОм; ComponentLink1Description: New link; ComponentLink1URL: *
R19 = RES_2512: Резистор, типоразмера 2512; Value: 1.8; Unit_of_measurement: кОм; ComponentLink1Description: New link; ComponentLink1URL: *
VD7 = BZX384-C18: Стабилитрон 10В 0.3Вт [SOD-323]; Unit_of_measurement: Ом; Value: *; ComponentLink1Description: New link; ComponentLink1URL: *
VT1 = STD10PF06T4-VB: Транзистор P-MOSFET 60В 30А 34Вт [D-PAK]
VT2-VT5 = IRF7854TRPBF: Транзистор, HEXFET, N-канал, 80В, 10А [SOIC-8]; pin to pad: 1>4 2>1+2+3 3>5+6+7+8
XP5 XP6 = XT30PW-M: Socket; DC supply; XT30; male; PIN: 2; on PCBs; THT; yellow; 15A; 500V

## Sheet Лист 4.SchDoc
size 420 x 297 mm; Author: ALTIUM GOSTBOM2.0 KEV; SheetNumber: 4; SheetTotal: 4; Обозначение_Код: ФЮРА.442576.001 Э3
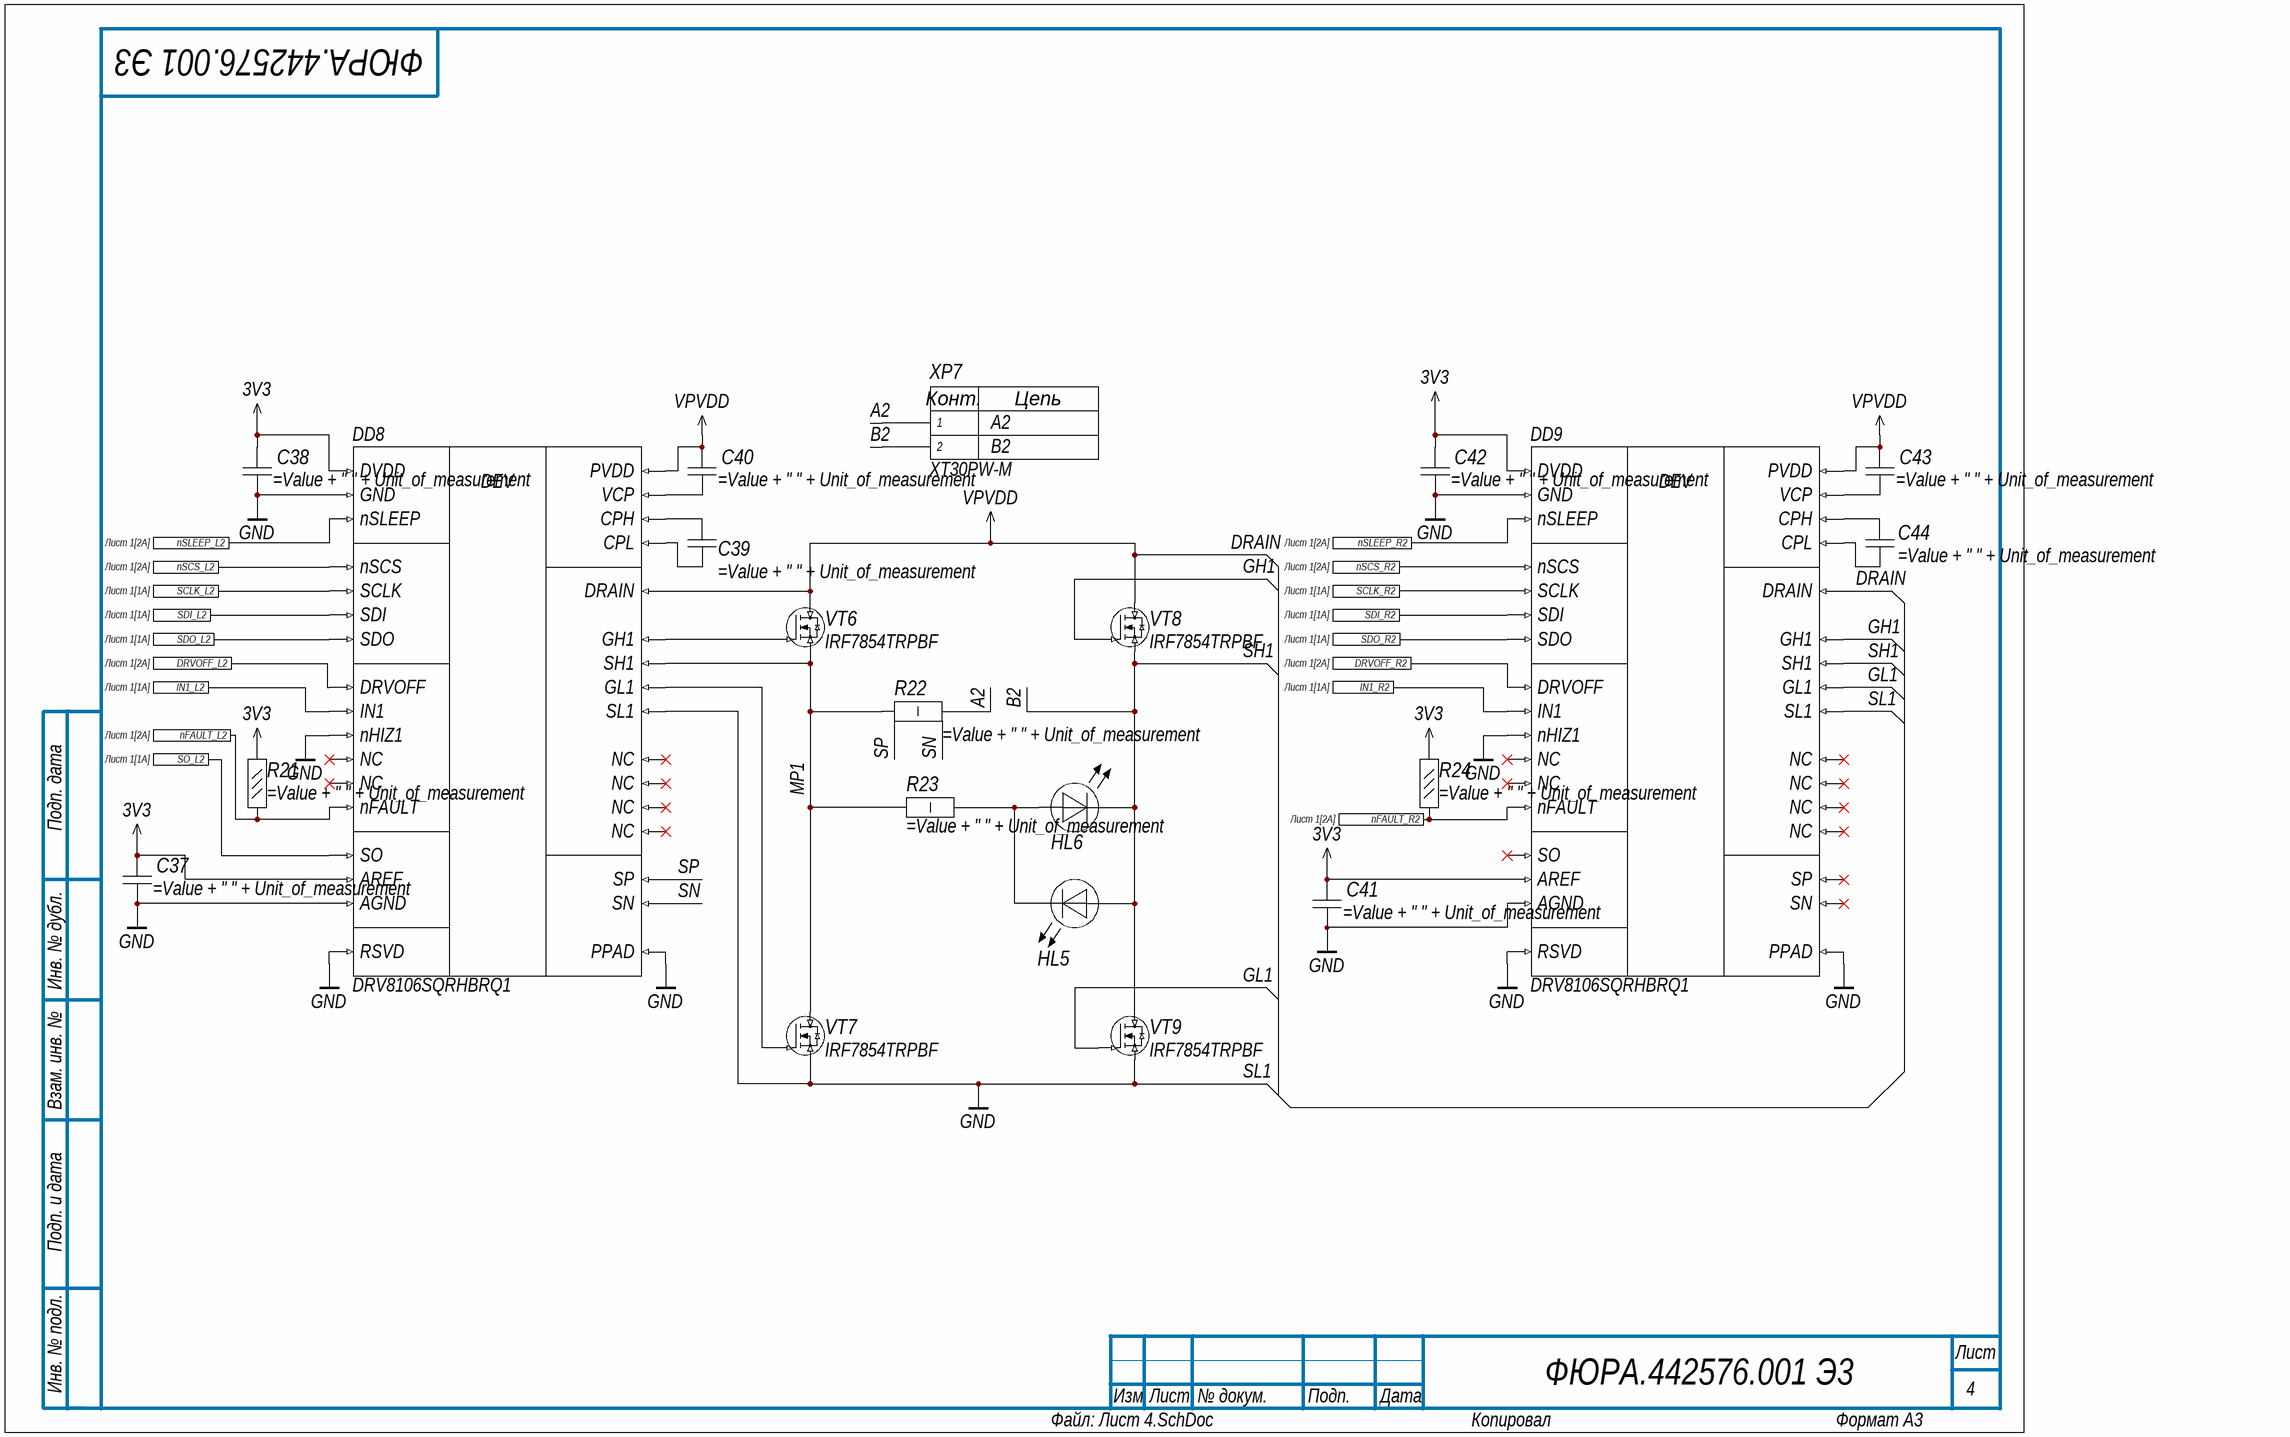
[diagram p3: Лист 4.SchDoc]

### Parts
C37  (no value)  [CAP_0603]
C38  (no value)  [CAP_0603]
C39  (no value)  [CAP_0603]
C40  (no value)  [CAP_0603]
C41  (no value)  [CAP_0603]
C42  (no value)  [CAP_0603]
C43  (no value)  [CAP_0603]
C44  (no value)  [CAP_0603]
DD8  DRV8106SQRHBRQ1  [VQFN32]
DD9  DRV8106SQRHBRQ1  [VQFN32]
HL5  3  [LED_0805]  (value not drawn)
HL6  3  [LED_0805]  (value not drawn)
R21  (no value)  [RES_0603]
R22  (no value)  [RES_2512]
R23  (no value)  [RES_2512]
R24  (no value)  [RES_0603]
VT6  IRF7854TRPBF  [SOP-8 WithoutTP]
VT7  IRF7854TRPBF  [SOP-8 WithoutTP]
VT8  IRF7854TRPBF  [SOP-8 WithoutTP]
VT9  IRF7854TRPBF  [SOP-8 WithoutTP]
XP7  XT30PW-M  [XT30PW-M]

### Ports
DRVOFF_L2 (see Лист 1[2A]), DRVOFF_R2 (see Лист 1[2A]), IN1_L2 (see Лист 1[1A]), IN1_R2 (see Лист 1[1A]), nFAULT_L2 (see Лист 1[2A]), nFAULT_R2 (see Лист 1[2A]), nSCS_L2 (see Лист 1[2A]), nSCS_R2 (see Лист 1[2A]), nSLEEP_L2 (see Лист 1[2A]), nSLEEP_R2 (see Лист 1[2A]), SCLK_L2 (see Лист 1[1A]), SCLK_R2 (see Лист 1[1A]), SDI_L2 (see Лист 1[1A]), SDI_R2 (see Лист 1[1A]), SDO_L2 (see Лист 1[1A]), SDO_R2 (see Лист 1[1A]), SO_L2 (see Лист 1[1A])

### Nets
3V3: C37.2 C38.2 C41.2 C42.2 DD8.2(DVDD) DD8.16(AREF) DD9.2(DVDD) DD9.16(AREF) R21.2 R24.2  [project net VBAT]
DRAIN: C40.2 C43.2 DD8.28(DRAIN) DD8.29(PVDD) DD9.28(DRAIN) DD9.29(PVDD) VT6.3 VT8.3  [also labelled VPVDD]
SL1: C37.1 C38.1 C41.1 C42.1 DD8.0(PPAD) DD8.1(GND) DD8.8(nHIZ1) DD8.15(RSVD) DD8.17(AGND) DD8.23(SL1) DD9.0(PPAD) DD9.1(GND) DD9.8(nHIZ1) DD9.15(RSVD) DD9.17(AGND) DD9.23(SL1) VT7.2 VT9.2  [also labelled GND]
A2: R22.1 XP7.1  [project net A2_4]
B2: DD9.21(SH1) HL5.A HL6.C VT8.2 VT9.3 XP7.2  [also labelled SH1]  [project net B2_4]
BRIDGESLEEP_1: DD8.11(nSLEEP) DD9.11(nSLEEP) ; port nSLEEP_L2, port nSLEEP_R2
CS2: DD8.14(SO) ; port SO_L2
DRVOFF2: DD8.12(DRVOFF) DD9.12(DRVOFF) ; port DRVOFF_L2, port DRVOFF_R2
GH1: DD9.20(GH1) VT8.1  [project net GH1_4]
GL1: DD9.22(GL1) VT9.1  [project net GL1_4]
MP1: DD8.21(SH1) R22.2 R23.1 VT6.2 VT7.3  [project net MP1_4]
SN: DD8.19(SN) R22.1  [project net SN_4]
SP: DD8.18(SP) R22.2  [project net SP_4]
SPI1_MISO: DD8.6(SDO) DD9.6(SDO) ; port SDO_L2, port SDO_R2
SPI1_MOSI: DD8.5(SDI) DD9.5(SDI) ; port SDI_L2, port SDI_R2
SPI1_SCK: DD8.4(SCLK) DD9.4(SCLK) ; port SCLK_L2, port SCLK_R2
SPI1_SS3: DD8.3(nSCS) ; port nSCS_L2
SPI1_SS4: DD9.3(nSCS) ; port nSCS_R2
NetC39_1: C39.1 DD8.32(CPL)
NetC39_2: C39.2 DD8.31(CPH)
NetC40_1: C40.1 DD8.30(VCP)
NetC43_1: C43.1 DD9.30(VCP)
NetC44_1: C44.1 DD9.32(CPL)
NetC44_2: C44.2 DD9.31(CPH)
NetDD2_3: DD8.7(IN1) ; port IN1_L2
NetDD2_6: DD9.7(IN1) ; port IN1_R2
NetDD4_8: DD8.13(nFAULT) R21.1 ; port nFAULT_L2
NetDD4_9: DD9.13(nFAULT) R24.1 ; port nFAULT_R2
NetDD8_20: DD8.20(GH1) VT6.1
NetDD8_22: DD8.22(GL1) VT7.1
NetHL5_C: HL5.C HL6.A R23.2

Not connected (* = marked no-connect by the designer): DD8 9(NC)* 10(NC)* 24(NC)* 25(NC)* 26(NC)* 27(NC)*; DD9 9(NC)* 10(NC)* 14(SO)* 18(SP)* 19(SN)* 24(NC)* 25(NC)* 26(NC)* 27(NC)*

### Notes on the sheet
- A2
- B2
- Подп. дата
- Инв. № дубл.
- Взам. инв. №
- Подп. и дата
- Инв. № подл.
- Изм.
- Лист
- № докум.
- Подп.
- Дата
- ALTIUM GOSTBOM2.0 KEV
- Файл:
- Копировал
- Формат А3
- (in symbol DRV8106SQRHBRQ1) DEV
- (in symbol XT30PW-M) Конт.; Цепь

### Library data of the parts
C37 C38 C41 C42 = CAP_0603: as C25 on sheet Лист 3; ComponentLink1Description: New link; ComponentLink1URL: *
C39 C44 = CAP_0603: as C27 on sheet Лист 3; ComponentLink1Description: New link; ComponentLink1URL: *
C40 C43 = CAP_0603: as C29 on sheet Лист 3; ComponentLink1Description: New link; ComponentLink1URL: *
DD8 DD9 = DRV8106SQRHBRQ1: as DD6 on sheet Лист 3
HL5 HL6 = LED_0805: as HL3 on sheet Лист 3; Value: *; ComponentLink1Description: New link; ComponentLink1URL: *
R21 R24 = RES_0603: as R3 on sheet Лист 1; ComponentLink1Description: New link; ComponentLink1URL: *
R22 = ResShunt_2512: as R18 on sheet Лист 3; ComponentLink1Description: New link; ComponentLink1URL: *
R23 = RES_2512: as R19 on sheet Лист 3; ComponentLink1Description: New link; ComponentLink1URL: *
VT6-VT9 = IRF7854TRPBF: Транзистор, HEXFET, N-канал, 80В, 10А [SOIC-8]; pin to pad: 1>4 2>1+2+3 3>5+6+7+8
XP7 = XT30PW-M: as XP5 on sheet Лист 3

## Nets that join several sheets
DRAIN: Лист 2 (C22.2 C23.2 DA2.6 R14.1), Лист 3 (14 pins), Лист 4 (8 pins)
SL1: Лист 1 (30 pins), Лист 2 (22 pins), Лист 3 (22 pins), Лист 4 (18 pins)
VBAT: Лист 1 (22 pins), Лист 2 (8 pins), Лист 3 (12 pins), Лист 4 (10 pins)
BRIDGESLEEP_1: Лист 1 (DD4.34), Лист 4 (DD8.11 DD9.11)
BRIDGESLEEP_2: Лист 1 (DD4.10), Лист 3 (DD6.11 DD7.11)
CS1: Лист 1 (DD4.17), Лист 3 (DD6.14)
CS2: Лист 1 (DD4.16), Лист 4 (DD8.14)
DRVOFF1: Лист 1 (DD4.33), Лист 3 (DD6.12 DD7.12)
DRVOFF2: Лист 1 (DD4.11), Лист 4 (DD8.12 DD9.12)
NetDD2_3: Лист 1 (DD2.3), Лист 4 (DD8.7)
NetDD2_6: Лист 1 (DD2.6), Лист 4 (DD9.7)
NetDD2_8: Лист 1 (DD2.8), Лист 3 (DD7.7)
NetDD2_11: Лист 1 (DD2.11), Лист 3 (DD6.7)
NetDD4_8: Лист 1 (DD4.8), Лист 4 (DD8.13 R21.1)
NetDD4_9: Лист 1 (DD4.9), Лист 4 (DD9.13 R24.1)
NetDD4_35: Лист 1 (DD4.35), Лист 3 (DD7.13 R20.1)
NetDD4_36: Лист 1 (DD4.36), Лист 3 (DD6.13 R16.1)
NetDD4_43: Лист 1 (DD4.43), Лист 2 (R15.2 VD6.1 XS1.2)
NetDD4_57: Лист 1 (DD4.57), Лист 2 (DD5.2 DD5.3)
SPI1_MISO: Лист 1 (DD4.22), Лист 3 (DD6.6 DD7.6), Лист 4 (DD8.6 DD9.6)
SPI1_MOSI: Лист 1 (DD4.23), Лист 3 (DD6.5 DD7.5), Лист 4 (DD8.5 DD9.5)
SPI1_SCK: Лист 1 (DD4.21), Лист 3 (DD6.4 DD7.4), Лист 4 (DD8.4 DD9.4)
SPI1_SS1: Лист 1 (DD4.20), Лист 3 (DD6.3)
SPI1_SS2: Лист 1 (DD4.24), Лист 3 (DD7.3)
SPI1_SS3: Лист 1 (DD4.25), Лист 4 (DD8.3)
SPI1_SS4: Лист 1 (DD4.26), Лист 4 (DD9.3)
USART1_RX: Лист 1 (DD4.59), Лист 2 (DD5.1)
USART1_TX: Лист 1 (DD4.58), Лист 2 (DD5.4)
USB_D_N: Лист 1 (DD4.44), Лист 2 (V1.6)
USB_D_P: Лист 1 (DD4.45), Лист 2 (V1.4)